# Altium schematic sheet EN-C200_RA0_USB_只有元器件.SchDoc
size A4
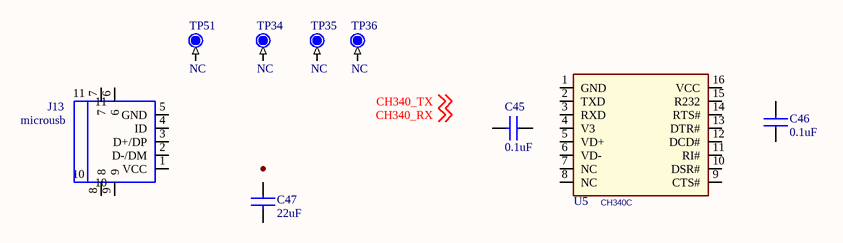
[diagram p0: EN-C200_RA0_USB_只有元器件.SchDoc]

## Parts
C45  0.1uF  [SC0603]
C46  0.1uF  [SC0603]
C47  22uF  [SC0805]
J13  microusb  [MICROUSB_D]
TP34  NC  [TP32-SMD]
TP35  NC  [TP32-SMD]
TP36  NC  [TP32-SMD]
TP51  NC  [TP32-SMD]
U5  CH340C  [SOP16-50-150A]

## Nets

Not connected (* = marked no-connect by the designer): C45 1 2; C46 1 2; C47 1 2; J13 1(VCC) 2(D-/DM) 3(D+/DP) 4(ID) 5(GND) 6 7 8 9 10 11; TP34 1; TP35 1; TP36 1; TP51 1; U5 1(GND) 2(TXD) 3(RXD) 4(V3) 5(VD+) 6(VD-) 7(NC) 8(NC) 9(CTS#) 10(DSR#) 11(RI#) 12(DCD#) 13(DTR#) 14(RTS#) 15(R232) 16(VCC)

## Notes on the sheet
- Labels drawn without touching a wire or pin: CH340_RX, CH340_TX

## Library data of the parts
C45-C47 = CAP NP
TP34-TP36 TP51 = TP
U5 = CH340C_0